# EAGLE schematic TeensyServoController (EAGLE 7.2.0)
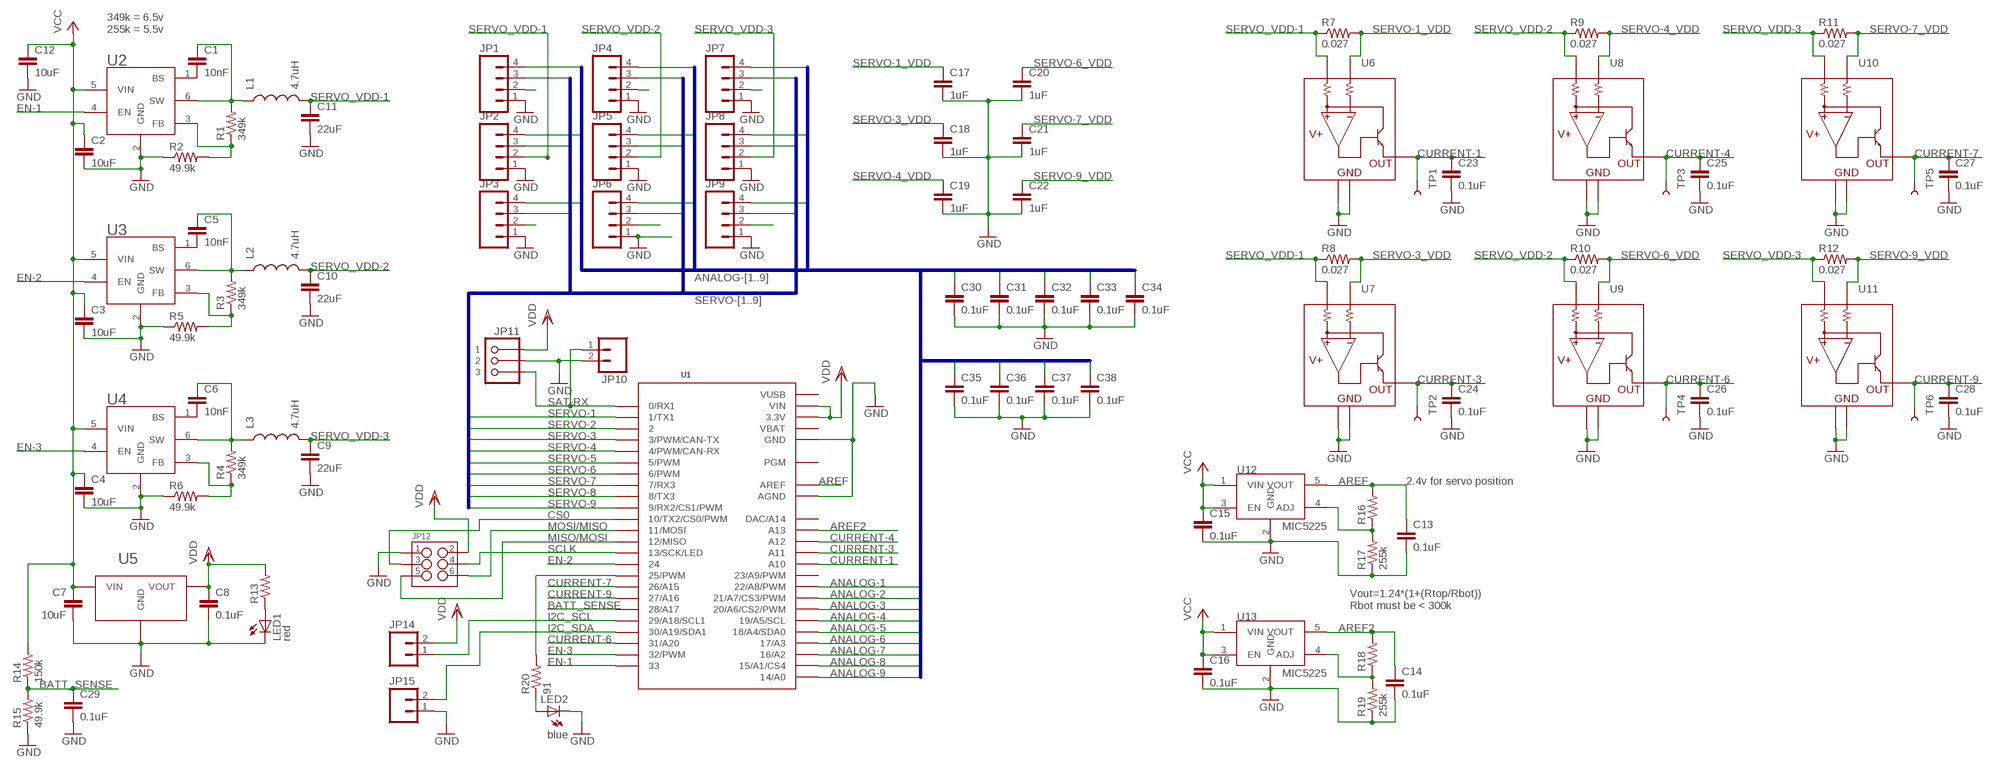
[diagram p0: schematic, sheet 1]

## Parts
C1  10nF  C-EUC0402  [C0402]
C2  10uF  C-EUC0805  [C0805]
C3  10uF  C-EUC0805  [C0805]
C4  10uF  C-EUC0805  [C0805]
C5  10nF  C-EUC0402  [C0402]
C6  10nF  C-EUC0402  [C0402]
C7  10uF  C-EUC0805  [C0805]
C8  0.1uF  C-EUC0603  [C0603]
C9  22uF  C-EUC0603  [C0603]
C10  22uF  C-EUC0603  [C0603]
C11  22uF  C-EUC0603  [C0603]
C12  10uF  C-EUC0805  [C0805]
C13  0.1uF  C-EUC0402  [C0402]
C14  0.1uF  C-EUC0402  [C0402]
C15  0.1uF  C-EUC0603  [C0603]
C16  0.1uF  C-EUC0603  [C0603]
C17  1uF  C-EUC0603  [C0603]
C18  1uF  C-EUC0603  [C0603]
C19  1uF  C-EUC0603  [C0603]
C20  1uF  C-EUC0603  [C0603]
C21  1uF  C-EUC0603  [C0603]
C22  1uF  C-EUC0603  [C0603]
C23  0.1uF  C-EUC0402  [C0402]
C24  0.1uF  C-EUC0402  [C0402]
C25  0.1uF  C-EUC0402  [C0402]
C26  0.1uF  C-EUC0402  [C0402]
C27  0.1uF  C-EUC0402  [C0402]
C28  0.1uF  C-EUC0402  [C0402]
C29  0.1uF  C-EUC0402  [C0402]
C30  0.1uF  C-EUC0402  [C0402]
C31  0.1uF  C-EUC0402  [C0402]
C32  0.1uF  C-EUC0402  [C0402]
C33  0.1uF  C-EUC0402  [C0402]
C34  0.1uF  C-EUC0402  [C0402]
C35  0.1uF  C-EUC0402  [C0402]
C36  0.1uF  C-EUC0402  [C0402]
C37  0.1uF  C-EUC0402  [C0402]
C38  0.1uF  C-EUC0402  [C0402]
JP1  M04PTH  [1X04]
JP2  M04PTH  [1X04]
JP3  M04PTH  [1X04]
JP4  M04PTH  [1X04]
JP5  M04PTH  [1X04]
JP6  M04PTH  [1X04]
JP7  M04PTH  [1X04]
JP8  M04PTH  [1X04]
JP9  M04PTH  [1X04]
JP10  M02PTH  [1X02]
JP11  3-PIN_JST_ZH_PTH_CONNECTORRIGHT_ANGLE_PTH  [3-PIN_JST_ZH_CONNECTOR_TH]
JP12  M03X22X3_SILK_SM  [2X3]
JP14  M02PTH  [1X02]
JP15  M02PTH  [1X02]
L1  4.7uH  INDUCTOR  [1008]
L2  4.7uH  INDUCTOR  [1008]
L3  4.7uH  INDUCTOR  [1008]
LED1  red  LED0603  [LED-0603]
LED2  blue  LED0603  [LED-0603]
R1  349k  R-US_R0402  [R0402]
R2  49.9k  R-US_R0402  [R0402]
R3  349k  R-US_R0402  [R0402]
R4  349k  R-US_R0402  [R0402]
R5  49.9k  R-US_R0402  [R0402]
R6  49.9k  R-US_R0402  [R0402]
R7  0.027  R-US_R0603  [R0603]
R8  0.027  R-US_R0603  [R0603]
R9  0.027  R-US_R0603  [R0603]
R10  0.027  R-US_R0603  [R0603]
R11  0.027  R-US_R0603  [R0603]
R12  0.027  R-US_R0603  [R0603]
R13  R-US_R0402  [R0402]
R14  150k  R-US_R0402  [R0402]
R15  49.9k  R-US_R0402  [R0402]
R16  R-US_R0603  [R0603]
R17  255k  R-US_R0603  [R0603]
R18  R-US_R0603  [R0603]
R19  255k  R-US_R0603  [R0603]
R20  91  R-US_R0402  [R0402]
TP1  TEST-POINT3  [PAD.03X.03]
TP2  TEST-POINT3  [PAD.03X.03]
TP3  TEST-POINT3  [PAD.03X.03]
TP4  TEST-POINT3  [PAD.03X.03]
TP5  TEST-POINT3  [PAD.03X.03]
TP6  TEST-POINT3  [PAD.03X.03]
U1  TEENSY_3.1_ALLPINS  [TEENSY_3.0_ALLPINS]
U2  AP3211KTR-G1  AP3211_SWITCHING_REGULATOR  [SOT-23-6]
U3  AP3211KTR-G1  AP3211_SWITCHING_REGULATOR  [SOT-23-6]
U4  AP3211KTR-G1  AP3211_SWITCHING_REGULATOR  [SOT-23-6]
U5  AP2210N-3.3TRG1  AP7313SOT23R  [SOT23]
U6  TS1102  [SOT23-5]
U7  TS1102  [SOT23-5]
U8  TS1102  [SOT23-5]
U9  TS1102  [SOT23-5]
U10  TS1102  [SOT23-5]
U11  TS1102  [SOT23-5]
U12  MIC5225  [SOT23-5]
U13  MIC5225  [SOT23-5]

## Nets
ANALOG-1: C30.1 JP1.4 U1.22/A8(22/A8/PWM)
ANALOG-2: C31.1 JP2.4 U1.21/A7(21/A7/CS3/PWM)
ANALOG-3: C32.1 JP3.4 U1.20/A6(20/A6/CS2/PWM)
ANALOG-4: C33.1 JP4.4 U1.19/A5(19/A5/SCL)
ANALOG-5: C34.1 JP5.4 U1.18/A4(18/A4/SDA0)
ANALOG-6: C35.1 JP6.4 U1.17/A3
ANALOG-7: C36.1 JP7.4 U1.16/A2
ANALOG-8: C37.1 JP8.4 U1.15/A1(15/A1/CS4)
ANALOG-9: C38.1 JP9.4 U1.14/A0
AREF: C13.1 R16.2 U1.AREF U12.5(VOUT)
AREF2: C14.1 R18.2 U1.A13 U13.5(VOUT)
BATT_SENSE: C29.1 R14.1 R15.2 U1.28(28/A17)
CS0: JP12.3 U1.10(10/TX2/CS0/PWM)
CURRENT-1: C23.1 TP1.P$1 U1.A10 U6.3(OUT)
CURRENT-3: C24.1 TP2.P$1 U1.A11 U7.3(OUT)
CURRENT-4: C25.1 TP3.P$1 U1.A12 U8.3(OUT)
CURRENT-6: C26.1 TP4.P$1 U1.31(31/A20) U9.3(OUT)
CURRENT-7: C27.1 TP5.P$1 U1.26(26/A15) U10.3(OUT)
CURRENT-9: C28.1 TP6.P$1 U1.27(27/A16) U11.3(OUT)
EN-1: U1.33 U2.4(EN)
EN-2: U1.24 U3.4(EN)
EN-3: U1.32(32/PWM) U4.4(EN)
GND: C2.2 C3.2 C4.2 C7.2 C8.2 C9.2 C10.2 C11.2 C12.2 C13.2 C14.2 C15.2 C16.2 C17.2 C18.2 C19.2 C20.2 C21.2 C22.2 C23.2 C24.2 C25.2 C26.2 C27.2 C28.2 C29.2 C30.2 C31.2 C32.2 C33.2 C34.2 C35.2 C36.2 C37.2 C38.2 JP1.1 JP2.1 JP3.1 JP4.1 JP5.1 JP6.1 JP7.1 JP8.1 JP9.1 JP10.2 JP11.P$2 JP12.1 JP15.1 LED1.C LED2.C R2.1 R5.1 R6.1 R15.1 R17.1 R19.1 U1.AGND U1.GND U1.GND1(GND) U1.GND2(GND) U2.2(GND) U3.2(GND) U4.2(GND) U5.P$1(GND) U6.1(GND) U6.2 U7.1(GND) U7.2 U8.1(GND) U8.2 U9.1(GND) U9.2 U10.1(GND) U10.2 U11.1(GND) U11.2 U12.2(GND) U13.2(GND)
I2C_SCL: JP14.1 U1.29(29/A18/SCL1)
I2C_SDA: JP15.2 U1.30(30/A19/SDA1)
MISO/MOSI: JP12.5 U1.12(12/MISO)
MOSI/MISO: JP12.6 U1.11(11/MOSI)
N$1: LED1.A R13.1
N$6: R1.1 R2.2 U2.3(FB)
N$7: R16.1 R17.2 U12.4(ADJ)
N$8: R20.2 U1.25(25/PWM)
N$9: R18.1 R19.2 U13.4(ADJ)
N$10: LED2.A R20.1
N$11: C5.1 L2.P$1 R3.2 U3.6(SW)
N$13: C1.1 L1.P$1 R1.2 U2.6(SW)
N$14: C1.2 U2.1(BS)
N$16: R4.1 R6.2 U4.3(FB)
N$17: C5.2 U3.1(BS)
N$18: R3.1 R5.2 U3.3(FB)
N$19: C6.2 U4.1(BS)
N$20: C6.1 L3.P$1 R4.2 U4.6(SW)
SAT-RX: JP10.1 JP11.P$3 U1.0(0/RX1)
SCLK: JP12.4 U1.13(13/SCK/LED)
SERVO-1: JP1.3 U1.1(1/TX1)
SERVO-1_VDD: C17.1 JP1.2 R7.2 U6.4(RS-)
SERVO-2: JP2.3 U1.2
SERVO-3: JP3.3 U1.3(3/PWM/CAN-TX)
SERVO-3_VDD: C18.1 JP3.2 R8.2 U7.4(RS-)
SERVO-4: JP4.3 U1.4(4/PWM/CAN-RX)
SERVO-4_VDD: C19.1 JP4.2 R9.2 U8.4(RS-)
SERVO-5: JP5.3 U1.5(5/PWM)
SERVO-6: JP6.3 U1.6(6/PWM)
SERVO-6_VDD: C20.1 JP6.2 R10.2 U9.4(RS-)
SERVO-7: JP7.3 U1.7(7/RX3)
SERVO-7_VDD: C21.1 JP7.2 R11.2 U10.4(RS-)
SERVO-8: JP8.3 U1.8(8/TX3)
SERVO-9: JP9.3 U1.9(9/RX2/CS1/PWM)
SERVO-9_VDD: C22.1 JP9.2 R12.2 U11.4(RS-)
SERVO_VDD-1: C11.1 JP2.2 L1.P$2 R7.1 R8.1 U6.5(RS+) U7.5(RS+)
SERVO_VDD-2: C10.1 JP5.2 L2.P$2 R9.1 R10.1 U8.5(RS+) U9.5(RS+)
SERVO_VDD-3: C9.1 JP8.2 L3.P$2 R11.1 R12.1 U10.5(RS+) U11.5(RS+)
VCC: C2.1 C3.1 C4.1 C7.1 C12.1 C15.1 C16.1 R14.2 U2.5(VIN) U3.5(VIN) U4.5(VIN) U5.P$3(VIN) U12.1(VIN) U12.3(EN) U13.1(VIN) U13.3(EN)
VDD: C8.1 JP11.P$1 JP12.2 JP14.2 R13.2 U1.3.3V U1.3.3V1(3.3V) U1.3.3V2(3.3V) U1.VIN U5.P$2(VOUT)
Unconnected: U1.23/A9(23/A9/PWM) U1.PGM U1.RESET(DAC/A14)

## Buses
SERVO-[1..9]
ANALOG-[1..9]

## Notes on the sheet
- 349k = 6.5v
  255k = 5.5v
- 2.4v for servo position
- Vout=1.24*(1+(Rtop/Rbot))
  Rbot must be < 300k

## Power pins joined to a net without a drawn wire
VBAT: U1.VBAT
VUSB: U1.VUSB

## Library data of the parts
C1-C38 = resistor:C-EU: CAPACITOR, European symbol
JP1-JP9 = SparkFun-Connectors:M04: Header 4 Standard 4-pin 0.1" header. Use with straight break away headers (SKU : PRT-00116), right angle break away headers (PRT-00553), swiss pins (PRT-00743), machine pins (PRT-00117), and female headers (PRT-00115). Molex polarized connector foot print use with SKU : PRT-08231 with associated crimp pins and housings. 1MM SMD Version SKU: PRT-10208
JP10 JP14 JP15 = SparkFun-Connectors:M02: Header 2 Standard 2-pin 0.1" header. Use with straight break away headers (SKU : PRT-00116), right angle break away headers (PRT-00553), swiss pins (PRT-00743), machine pins (PRT-00117), and female headers (PRT-00115). Molex polarized connector foot print use with SKU : PRT-08233 with associated crimp pins and housings.
JP11 = My Parts:3-PIN_JST_ZH_PTH_CONNECTOR
JP12 = SparkFun-Connectors:M03X2: 2x3 .1" header. Shrouded, with keying- CONN-10681 SMT- CONN-11415 Pogo pins- HW-11044
L1-L3 = inductors:INDUCTOR: Inductors Basic Inductor/Choke - 0603 and 1206. Footprints are not proven and vary greatly between part numbers.
LED1 LED2 = SparkFun-LED:LED: LEDs Standard schematic elements and footprints for 5mm, 3mm, 1206, and 0603 sized LEDs. 5mm - Spark Fun Electronics SKU : COM-00529 (and others)
R1-R20 = resistor:R-US_: RESISTOR, American symbol
TP1-TP6 = SparkFun-Passives:TEST-POINT: Bare copper test points for troubleshooting or ICT
U1 = Teensy3.0:TEENSY_3.1_ALLPINS
U2-U4 = My Parts:AP3211_SWITCHING_REGULATOR
U5 = My Parts:AP7313: 3.3v LDO Voltage Regulator
U6-U11 = My Parts:TS1102: High-side shunt current sense
U12 U13 = My Parts:MIC5225